# Altium schematic sheet AUDIO.SchDoc
size 386 x 246 mm
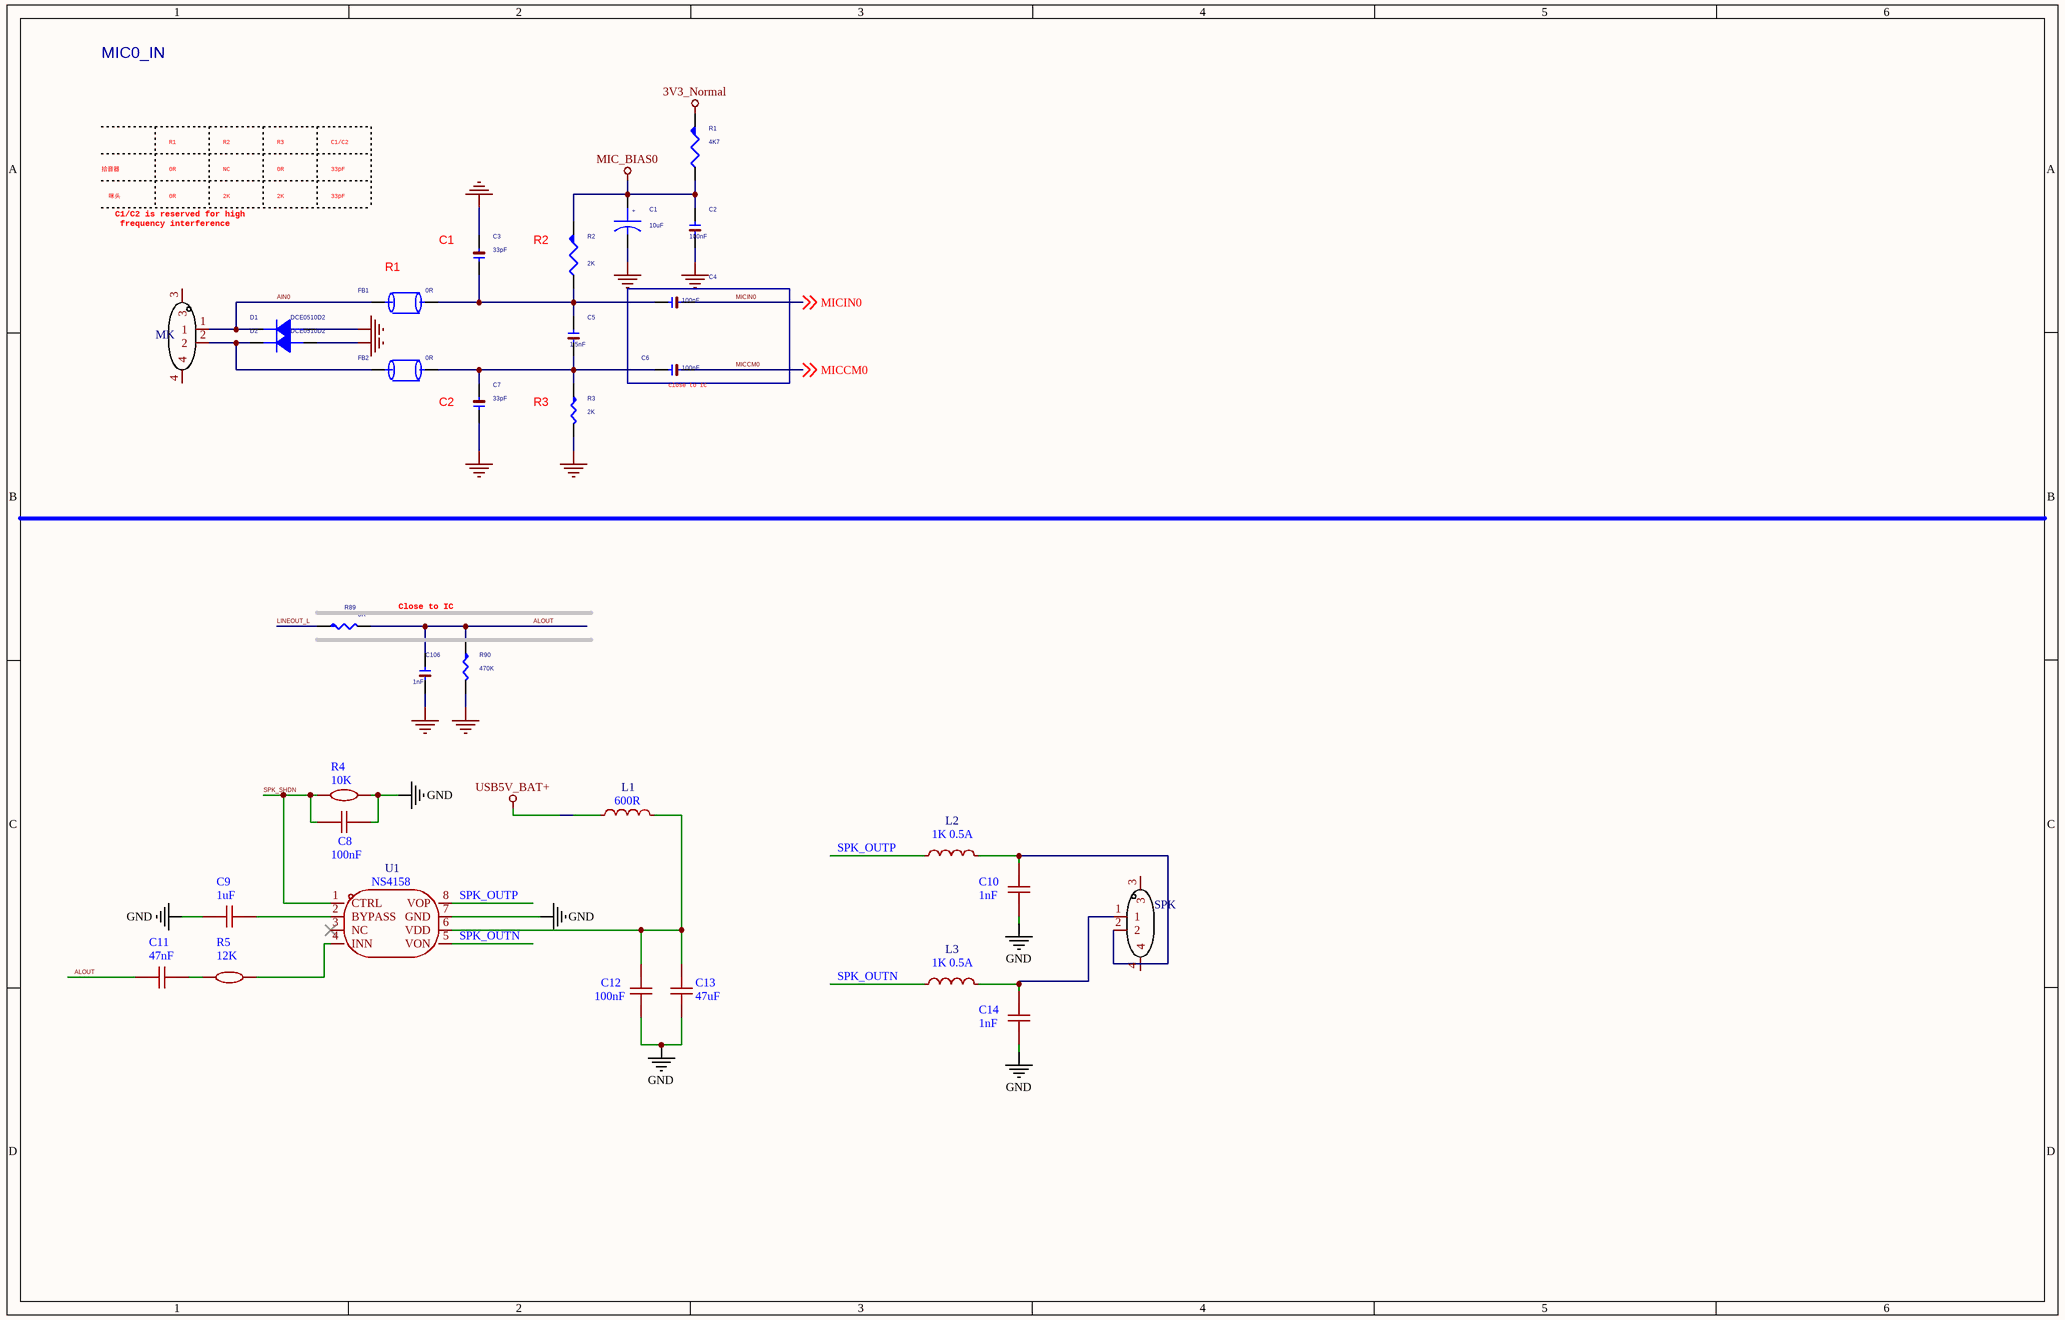
[diagram p0: AUDIO.SchDoc]

## Parts
C1  10uF  [C0603]
C2  100nF  [C0402]
C3  33pF  [C0402]
C4  100nF  [C0402]
C5  1.5nF  [C0402]
C6  100nF  [C0402]
C7  33pF  [C0402]
C8  100nF  [C0402]
C9  1uF  [C0805]
C10  1nF  [C0805]
C11  47nF  [C0805]
C12  100nF  [C0805]
C13  47uF  [C1206]
C14  1nF  [C0805]
C106  1nF  [C0805]
CON1  MK  [CONN-SMD_2P-P1.25-LT]
CON2  SPK  [CONN-SMD_2.0-2PLT]
D1  DCE0510D2  [D0402_0.55x0.6]
D2  DCE0510D2  [D0402_0.55x0.6]
FB1  0R  [R0402]
FB2  0R  [R0402]
L1  600R  [L1206]
L2  1K 0.5A  [L0805]
L3  1K 0.5A  [L0805]
R1  4K7  [R0402]
R2  2K  [R0402]
R3  2K  [R0402]
R4  10K  [R0402]
R5  12K  [R0402]
R89  0R  [R0402]
R90  470K  [R0402]
U1  NS4158  [SOIC-8_L4.9-W3.9-P1.27-LS6.0-BL]

## Nets
3V3_Normal: R1.1
GND: C1.2 C2.2 C3.1 C7.2 C8.2 C9.1 C10.1 C12.1 C13.1 C14.1 C106.2 D1.1(A) D2.1(A) R3.2 R4.2 R90.2 U1.7(GND)
MIC_BIAS0: C1.1 C2.1 R1.2 R2.1
USB5V_BAT+: L1.1
AIN0: CON1.1 D1.2(K) FB1.1
ALOUT: C11.1 C106.1 R89.2 R90.1
LINEOUT_L: R89.1
MICCM0: C6.2 ; off-sheet MICCM0
MICIN0: C4.2 ; off-sheet MICIN0
SPK_OUTN: L3.1 U1.5(VON)
SPK_OUTP: L2.1 U1.8(VOP)
SPK_SHDN: C8.1 R4.1 U1.1(CTRL)
NetC3_2: C3.2 C4.1 C5.1 FB1.2 R2.2
NetC5_2: C5.2 C6.1 C7.1 FB2.2 R3.1
NetC9_2: C9.2 U1.2(BYPASS)
NetC10_2: C10.2 CON2.2 L2.2
NetC11_2: C11.2 R5.1
NetC12_2: C12.2 C13.2 L1.2 U1.6(VDD)
NetC14_2: C14.2 CON2.1 L3.2
NetCON1_2: CON1.2 D2.2(K) FB2.1
NetR5_2: R5.2 U1.4(INN)

Not connected (* = marked no-connect by the designer): CON1 3 4; CON2 3 4; U1 3(NC)*

## Notes on the sheet
- MIC0_IN
- 拾音器
- 0R
- R1
- NC
- R2
- R3
- 33pF
- C1/C2
- 咪头
- C1/C2 is reserved for high
  frequency interference
- 2K
- (near C3) C1
- (near R2) R2
- (near FB1) R1
- (near C6) close to IC
- C2
- (near R3) R3
- Close to IC
- (in symbol CAP POL) +

## Library data of the parts
C1 = CAP POL
C2 C4-C6 C106 = C0805_10uF: Class: DISCRETE
C3 C7 = C0402: Class: DISCRETE
C8-C12 C14 = CAP_0805: Symbol: CapAcitance; Convert to PCB: yes; Device: CAP_0805; Add into BOM: yes; Supplier Footprint: 0805
  C8 C12: Value: 100nF
  C9: Value: 1uF
  C10 C14: Value: 1nF
  C11: Value: 47nF
C13 = CAP_1206: Symbol: CapAcitance; Convert to PCB: yes; Device: CAP_1206; Add into BOM: yes; Supplier Footprint: 1206; Value: 47uF
CON1 CON2 = HC-1.25-2PLT: Add into BOM: yes; Pins Structure: 1x2P; Pitch: 1.25mm; Number of PINs Per Row: 2; Current Rating (Max): 2A; Symbol: HC-1.25-2PLT; Device: HC-1.25-2PLT; Supplier Part: C2845388; Manufacturer Part: HC-1.25-2PLT; Supplier Footprint: SMD,P=1.25mm; JLCPCB Part Class: Extended Part; Datasheet: https://atta.szlcsc.com/upload/public/pdf/source/20230707/8E5913B5A3195C18F5EE12EA4CB86B82.pdf; Supplier: LCSC; Convert to PCB: yes; Reference Series: -; Number of Pins: 2P; Number of Rows: 1; Row Spacing: -
D1 D2 = DIODE_Dup1
FB1 FB2 = BEAD: BEAD/0402/120ohm/200MA; Part_Type: 0402贴片磁珠; Part_Number: 49223; CLASS: DISCRETE; Fanvil_Spec: 0402-600Ω&100M/100mA/FBMA-11-100505-601T; C5_Val: 120; C4_Unit: R; C3_Pkg: 0402; C1_Manu: SMT; Fanvil_Type: 磁珠; Fanvil_ID: INT.1013; C2_Type: BEAD
L1 = CBW321609U601T: Add into BOM: yes; Current Rating: 2A; Circuits: 1; Symbol: CBW321609U601T; Device: CBW321609U601T; Supplier: LCSC; Manufacturer Part: 600R; Supplier Part: C73732; Supplier Footprint: 1206; Datasheet: https://atta.szlcsc.com/upload/public/pdf/source/20190129/C361676_507080CDC8DBC2B0B7C2139C1873642D.pdf; Convert to PCB: yes
L2 L3 = SBK201209T-102Y-N: Add into BOM: yes; Current Rating: 200mA; Circuits: 1; Symbol: SBK201209T-102Y-N; Device: SBK201209T-102Y-N; Supplier Part: C142036; Supplier Footprint: 0805; Datasheet: https://atta.szlcsc.com/upload/public/pdf/source/20181119/C285644_F4950E68CEB7BD9E18B05382B5272067.pdf; Supplier: LCSC; Convert to PCB: yes
  L2: Manufacturer Part: SBK201209T-102Y-N
  L3: Manufacturer Part: 1K 0.5A
R1 R2 = R-PIN-Mark
R3 R90 = R0402: Class: DISCRETE
R4 = Res_0805: Convert to PCB: yes; Device: Res_0805; Add into BOM: yes; Supplier Footprint: 0805; Value: 10K
R5 = Res_0805: Convert to PCB: yes; Value: 30K; Device: Res_0805; Add into BOM: yes; Supplier Footprint: 0805
R89 = R0402_330R 5%: [ 330R +-5% ](0402); NPO; Part Name: CR0402J330RQ10; Brand: EVER OHMSぱ; Class: Resistor; Creator: Alan.Liu#6135/0920796617
U1 = NS4158: Add into BOM: yes; Symbol: NS4158; Device: NS4158; LCSC Part Name: NS4158; Supplier Part: C2890042; Manufacturer Part: NS4158; Supplier Footprint: SOIC-8; Datasheet: https://atta.szlcsc.com/upload/public/pdf/source/20210826/9C0306C24076E9EB95F6FF2952664B70.pdf; Supplier: LCSC; Convert to PCB: yes